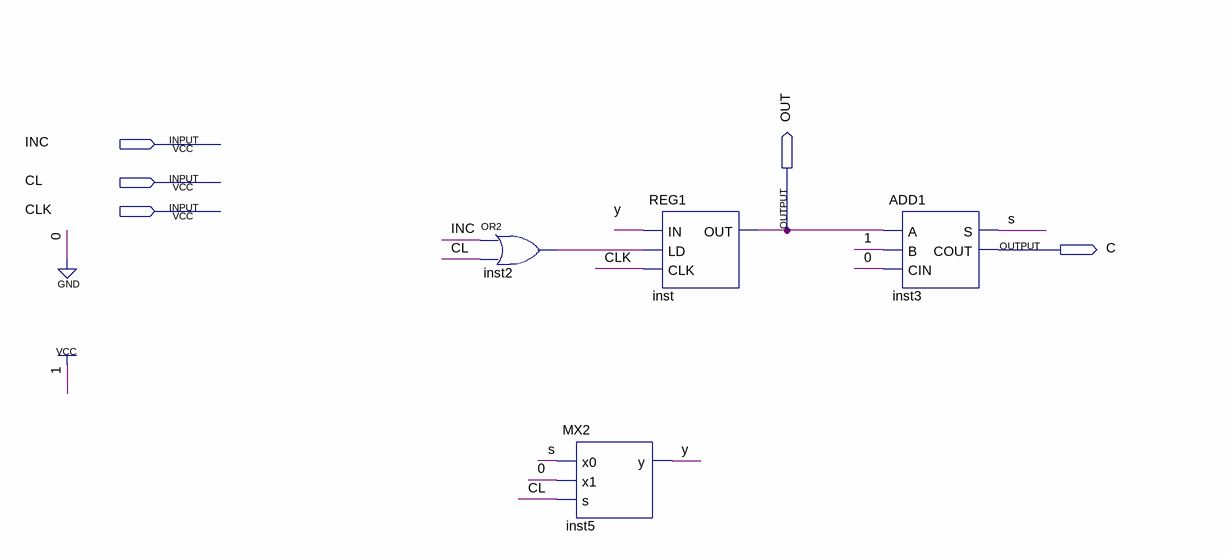
[diagram p0: schematic sheet]
// Quartus schematic REG1DEBOUNCER.bdf as structural Verilog: 4 symbols, 5 pins
module REG1DEBOUNCER (
  input  INC,
  input  CL,
  input  CLK,
  output OUT,
  output C
);

  wire inst2_out, s, y;

  or inst2 (inst2_out, INC, CL);
  MX2 inst5 (.x0(s), .x1(1'b0), .s(CL), .y(y));
  REG1 inst (.IN(y), .LD(inst2_out), .CLK(CLK), .OUT(OUT));
  ADD1 inst3 (.A(OUT), .B(1'b1), .CIN(1'b0), .S(s), .COUT(C));
endmodule
